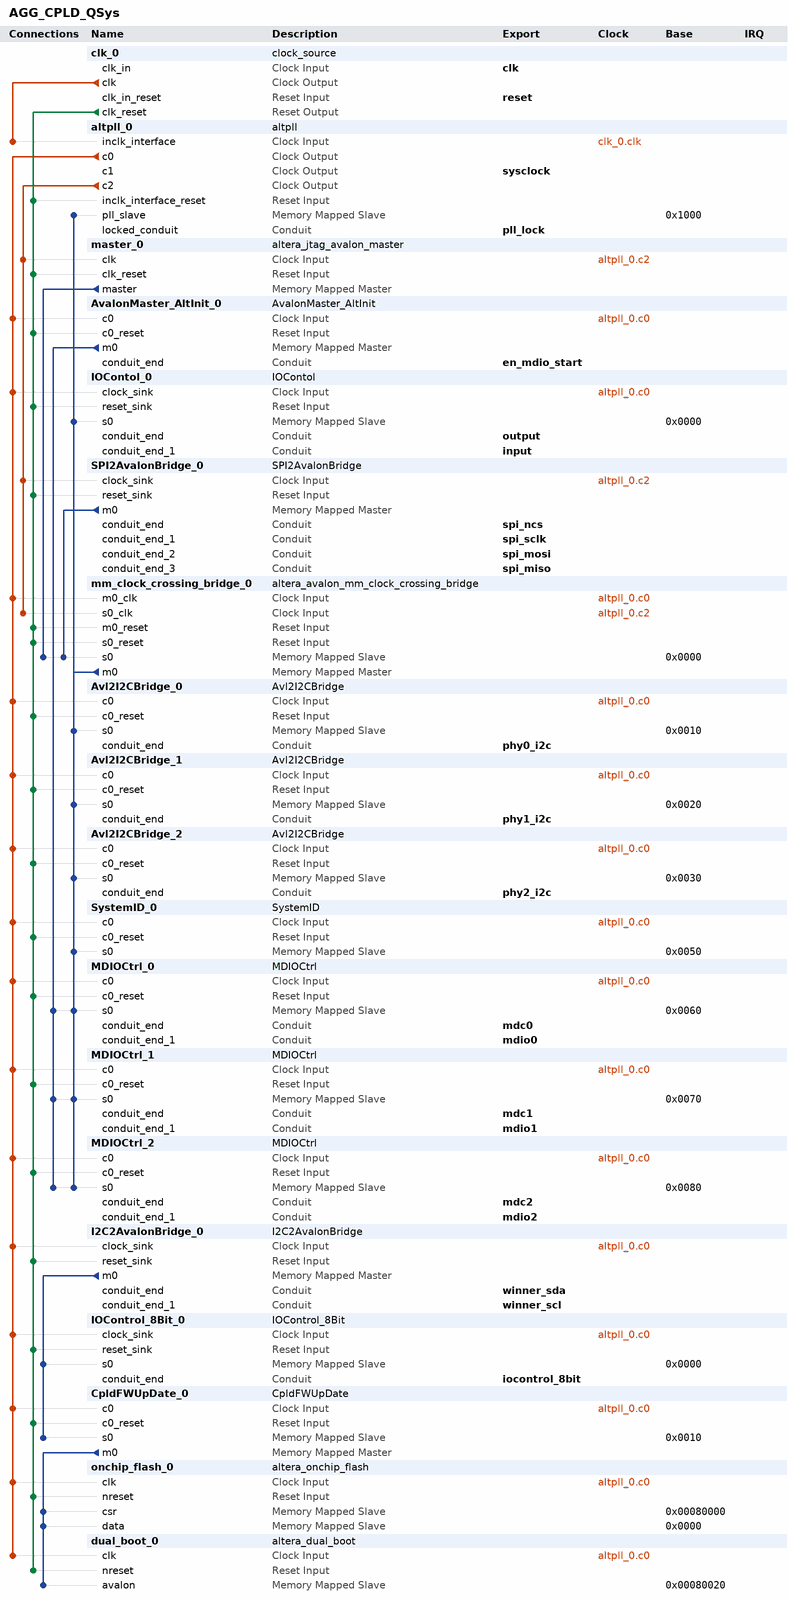
[diagram p0: system contents]
# Platform Designer (Qsys) system AGG_CPLD_QSys, MAX 10 10M16SCU169I7G
# Parameters at their usual value, and those the tool derives, are not listed.
package require -exact qsys 20.1
create_system AGG_CPLD_QSys
set_project_property DEVICE_FAMILY {MAX 10}
set_project_property DEVICE 10M16SCU169I7G

add_instance clk_0 clock_source 20.1
set_instance_parameter_value clk_0 clockFrequency 25000000

add_instance altpll_0 altpll 20.1
set_instance_parameter_value altpll_0 CLK0_DIVIDE_BY 1
set_instance_parameter_value altpll_0 CLK0_MULTIPLY_BY 1
set_instance_parameter_value altpll_0 CLK1_DIVIDE_BY 1
set_instance_parameter_value altpll_0 CLK1_DUTY_CYCLE 50
set_instance_parameter_value altpll_0 CLK1_MULTIPLY_BY 1
set_instance_parameter_value altpll_0 CLK1_PHASE_SHIFT 0
set_instance_parameter_value altpll_0 CLK2_DIVIDE_BY 1
set_instance_parameter_value altpll_0 CLK2_DUTY_CYCLE 50
set_instance_parameter_value altpll_0 CLK2_MULTIPLY_BY 4
set_instance_parameter_value altpll_0 CLK2_PHASE_SHIFT 0
set_instance_parameter_value altpll_0 INCLK0_INPUT_FREQUENCY 40000
set_instance_parameter_value altpll_0 PORT_ARESET PORT_UNUSED
set_instance_parameter_value altpll_0 PORT_LOCKED PORT_USED
set_instance_parameter_value altpll_0 PORT_clk1 PORT_USED
set_instance_parameter_value altpll_0 PORT_clk2 PORT_USED
set_instance_parameter_value altpll_0 PORT_clk3 PORT_UNUSED

add_instance master_0 altera_jtag_avalon_master 20.1

add_instance AvalonMaster_AltInit_0 AvalonMaster_AltInit 1.0

add_instance IOContol_0 IOContol 1.0

add_instance SPI2AvalonBridge_0 SPI2AvalonBridge 1.0

add_instance mm_clock_crossing_bridge_0 altera_avalon_mm_clock_crossing_bridge 20.1
set_instance_parameter_value mm_clock_crossing_bridge_0 ADDRESS_WIDTH 32
set_instance_parameter_value mm_clock_crossing_bridge_0 COMMAND_FIFO_DEPTH 4
set_instance_parameter_value mm_clock_crossing_bridge_0 DATA_WIDTH 32
set_instance_parameter_value mm_clock_crossing_bridge_0 MASTER_SYNC_DEPTH 2
set_instance_parameter_value mm_clock_crossing_bridge_0 MAX_BURST_SIZE 1
set_instance_parameter_value mm_clock_crossing_bridge_0 RESPONSE_FIFO_DEPTH 4
set_instance_parameter_value mm_clock_crossing_bridge_0 SLAVE_SYNC_DEPTH 2
set_instance_parameter_value mm_clock_crossing_bridge_0 USE_AUTO_ADDRESS_WIDTH 1

add_instance Avl2I2CBridge_0 Avl2I2CBridge 1.0

add_instance Avl2I2CBridge_1 Avl2I2CBridge 1.0

add_instance Avl2I2CBridge_2 Avl2I2CBridge 1.0

add_instance SystemID_0 SystemID 1.0

add_instance MDIOCtrl_0 MDIOCtrl 1.0

add_instance MDIOCtrl_1 MDIOCtrl 1.0

add_instance MDIOCtrl_2 MDIOCtrl 1.0

add_instance I2C2AvalonBridge_0 I2C2AvalonBridge 1.0
set_instance_parameter_value I2C2AvalonBridge_0 DevAdd 64

add_instance IOControl_8Bit_0 IOControl_8Bit 1.0

add_instance CpldFWUpDate_0 CpldFWUpDate 1.0

add_instance onchip_flash_0 altera_onchip_flash 20.1
set_instance_parameter_value onchip_flash_0 CLOCK_FREQUENCY 25.0
set_instance_parameter_value onchip_flash_0 CONFIGURATION_MODE {Single Compressed Image}
set_instance_parameter_value onchip_flash_0 SECTOR_ACCESS_MODE {Read and write,Read and write,Read only,Read and write,Read and write}
set_instance_parameter_value onchip_flash_0 initFlashContent false
set_instance_parameter_value onchip_flash_0 initializationFileName altera_onchip_flash.hex
set_instance_parameter_value onchip_flash_0 useNonDefaultInitFile false

add_instance dual_boot_0 altera_dual_boot 20.1
set_instance_parameter_value dual_boot_0 CLOCK_FREQUENCY 25.0

# connections
add_connection altpll_0.c0 AvalonMaster_AltInit_0.c0 clock
add_connection altpll_0.c0 Avl2I2CBridge_0.c0 clock
add_connection altpll_0.c0 Avl2I2CBridge_1.c0 clock
add_connection altpll_0.c0 Avl2I2CBridge_2.c0 clock
add_connection altpll_0.c0 CpldFWUpDate_0.c0 clock
add_connection altpll_0.c0 dual_boot_0.clk clock
add_connection altpll_0.c0 I2C2AvalonBridge_0.clock_sink clock
add_connection altpll_0.c0 IOContol_0.clock_sink clock
add_connection altpll_0.c0 IOControl_8Bit_0.clock_sink clock
add_connection altpll_0.c0 MDIOCtrl_0.c0 clock
add_connection altpll_0.c0 MDIOCtrl_1.c0 clock
add_connection altpll_0.c0 MDIOCtrl_2.c0 clock
add_connection altpll_0.c0 mm_clock_crossing_bridge_0.m0_clk clock
add_connection altpll_0.c0 onchip_flash_0.clk clock
add_connection altpll_0.c0 SystemID_0.c0 clock
add_connection altpll_0.c2 master_0.clk clock
add_connection altpll_0.c2 mm_clock_crossing_bridge_0.s0_clk clock
add_connection altpll_0.c2 SPI2AvalonBridge_0.clock_sink clock
add_connection clk_0.clk altpll_0.inclk_interface clock
add_connection clk_0.clk_reset altpll_0.inclk_interface_reset reset
add_connection clk_0.clk_reset AvalonMaster_AltInit_0.c0_reset reset
add_connection clk_0.clk_reset Avl2I2CBridge_0.c0_reset reset
add_connection clk_0.clk_reset Avl2I2CBridge_1.c0_reset reset
add_connection clk_0.clk_reset Avl2I2CBridge_2.c0_reset reset
add_connection clk_0.clk_reset CpldFWUpDate_0.c0_reset reset
add_connection clk_0.clk_reset dual_boot_0.nreset reset
add_connection clk_0.clk_reset I2C2AvalonBridge_0.reset_sink reset
add_connection clk_0.clk_reset IOContol_0.reset_sink reset
add_connection clk_0.clk_reset IOControl_8Bit_0.reset_sink reset
add_connection clk_0.clk_reset master_0.clk_reset reset
add_connection clk_0.clk_reset MDIOCtrl_0.c0_reset reset
add_connection clk_0.clk_reset MDIOCtrl_1.c0_reset reset
add_connection clk_0.clk_reset MDIOCtrl_2.c0_reset reset
add_connection clk_0.clk_reset mm_clock_crossing_bridge_0.m0_reset reset
add_connection clk_0.clk_reset mm_clock_crossing_bridge_0.s0_reset reset
add_connection clk_0.clk_reset onchip_flash_0.nreset reset
add_connection clk_0.clk_reset SPI2AvalonBridge_0.reset_sink reset
add_connection clk_0.clk_reset SystemID_0.c0_reset reset
add_connection AvalonMaster_AltInit_0.m0 MDIOCtrl_0.s0 avalon
set_connection_parameter_value AvalonMaster_AltInit_0.m0/MDIOCtrl_0.s0 baseAddress 0x0060
add_connection AvalonMaster_AltInit_0.m0 MDIOCtrl_1.s0 avalon
set_connection_parameter_value AvalonMaster_AltInit_0.m0/MDIOCtrl_1.s0 baseAddress 0x0070
add_connection AvalonMaster_AltInit_0.m0 MDIOCtrl_2.s0 avalon
set_connection_parameter_value AvalonMaster_AltInit_0.m0/MDIOCtrl_2.s0 baseAddress 0x0080
add_connection CpldFWUpDate_0.m0 dual_boot_0.avalon avalon
set_connection_parameter_value CpldFWUpDate_0.m0/dual_boot_0.avalon baseAddress 0x00080020
add_connection CpldFWUpDate_0.m0 onchip_flash_0.csr avalon
set_connection_parameter_value CpldFWUpDate_0.m0/onchip_flash_0.csr baseAddress 0x00080000
add_connection CpldFWUpDate_0.m0 onchip_flash_0.data avalon
set_connection_parameter_value CpldFWUpDate_0.m0/onchip_flash_0.data baseAddress 0x0000
add_connection I2C2AvalonBridge_0.m0 CpldFWUpDate_0.s0 avalon
set_connection_parameter_value I2C2AvalonBridge_0.m0/CpldFWUpDate_0.s0 baseAddress 0x0010
add_connection I2C2AvalonBridge_0.m0 IOControl_8Bit_0.s0 avalon
set_connection_parameter_value I2C2AvalonBridge_0.m0/IOControl_8Bit_0.s0 baseAddress 0x0000
add_connection master_0.master mm_clock_crossing_bridge_0.s0 avalon
set_connection_parameter_value master_0.master/mm_clock_crossing_bridge_0.s0 baseAddress 0x0000
add_connection mm_clock_crossing_bridge_0.m0 altpll_0.pll_slave avalon
set_connection_parameter_value mm_clock_crossing_bridge_0.m0/altpll_0.pll_slave baseAddress 0x1000
add_connection mm_clock_crossing_bridge_0.m0 Avl2I2CBridge_0.s0 avalon
set_connection_parameter_value mm_clock_crossing_bridge_0.m0/Avl2I2CBridge_0.s0 baseAddress 0x0010
add_connection mm_clock_crossing_bridge_0.m0 Avl2I2CBridge_1.s0 avalon
set_connection_parameter_value mm_clock_crossing_bridge_0.m0/Avl2I2CBridge_1.s0 baseAddress 0x0020
add_connection mm_clock_crossing_bridge_0.m0 Avl2I2CBridge_2.s0 avalon
set_connection_parameter_value mm_clock_crossing_bridge_0.m0/Avl2I2CBridge_2.s0 baseAddress 0x0030
add_connection mm_clock_crossing_bridge_0.m0 IOContol_0.s0 avalon
set_connection_parameter_value mm_clock_crossing_bridge_0.m0/IOContol_0.s0 baseAddress 0x0000
add_connection mm_clock_crossing_bridge_0.m0 MDIOCtrl_0.s0 avalon
set_connection_parameter_value mm_clock_crossing_bridge_0.m0/MDIOCtrl_0.s0 baseAddress 0x0060
add_connection mm_clock_crossing_bridge_0.m0 MDIOCtrl_1.s0 avalon
set_connection_parameter_value mm_clock_crossing_bridge_0.m0/MDIOCtrl_1.s0 baseAddress 0x0070
add_connection mm_clock_crossing_bridge_0.m0 MDIOCtrl_2.s0 avalon
set_connection_parameter_value mm_clock_crossing_bridge_0.m0/MDIOCtrl_2.s0 baseAddress 0x0080
add_connection mm_clock_crossing_bridge_0.m0 SystemID_0.s0 avalon
set_connection_parameter_value mm_clock_crossing_bridge_0.m0/SystemID_0.s0 baseAddress 0x0050
add_connection SPI2AvalonBridge_0.m0 mm_clock_crossing_bridge_0.s0 avalon
set_connection_parameter_value SPI2AvalonBridge_0.m0/mm_clock_crossing_bridge_0.s0 baseAddress 0x0000

# exported interfaces
add_interface clk clock sink
set_interface_property clk EXPORT_OF clk_0.clk_in
add_interface en_mdio_start conduit end
set_interface_property en_mdio_start EXPORT_OF AvalonMaster_AltInit_0.conduit_end
add_interface input conduit end
set_interface_property input EXPORT_OF IOContol_0.conduit_end_1
add_interface iocontrol_8bit conduit end
set_interface_property iocontrol_8bit EXPORT_OF IOControl_8Bit_0.conduit_end
add_interface mdc0 conduit end
set_interface_property mdc0 EXPORT_OF MDIOCtrl_0.conduit_end
add_interface mdc1 conduit end
set_interface_property mdc1 EXPORT_OF MDIOCtrl_1.conduit_end
add_interface mdc2 conduit end
set_interface_property mdc2 EXPORT_OF MDIOCtrl_2.conduit_end
add_interface mdio0 conduit end
set_interface_property mdio0 EXPORT_OF MDIOCtrl_0.conduit_end_1
add_interface mdio1 conduit end
set_interface_property mdio1 EXPORT_OF MDIOCtrl_1.conduit_end_1
add_interface mdio2 conduit end
set_interface_property mdio2 EXPORT_OF MDIOCtrl_2.conduit_end_1
add_interface output conduit end
set_interface_property output EXPORT_OF IOContol_0.conduit_end
add_interface phy0_i2c conduit end
set_interface_property phy0_i2c EXPORT_OF Avl2I2CBridge_0.conduit_end
add_interface phy1_i2c conduit end
set_interface_property phy1_i2c EXPORT_OF Avl2I2CBridge_1.conduit_end
add_interface phy2_i2c conduit end
set_interface_property phy2_i2c EXPORT_OF Avl2I2CBridge_2.conduit_end
add_interface pll_lock conduit end
set_interface_property pll_lock EXPORT_OF altpll_0.locked_conduit
add_interface reset reset sink
set_interface_property reset EXPORT_OF clk_0.clk_in_reset
add_interface spi_miso conduit end
set_interface_property spi_miso EXPORT_OF SPI2AvalonBridge_0.conduit_end_3
add_interface spi_mosi conduit end
set_interface_property spi_mosi EXPORT_OF SPI2AvalonBridge_0.conduit_end_2
add_interface spi_ncs conduit end
set_interface_property spi_ncs EXPORT_OF SPI2AvalonBridge_0.conduit_end
add_interface spi_sclk conduit end
set_interface_property spi_sclk EXPORT_OF SPI2AvalonBridge_0.conduit_end_1
add_interface sysclock clock source
set_interface_property sysclock EXPORT_OF altpll_0.c1
add_interface winner_scl conduit end
set_interface_property winner_scl EXPORT_OF I2C2AvalonBridge_0.conduit_end_1
add_interface winner_sda conduit end
set_interface_property winner_sda EXPORT_OF I2C2AvalonBridge_0.conduit_end

set_interconnect_requirement {$system} qsys_mm.clockCrossingAdapter HANDSHAKE
set_interconnect_requirement {$system} qsys_mm.enableEccProtection FALSE
set_interconnect_requirement {$system} qsys_mm.insertDefaultSlave FALSE
set_interconnect_requirement {$system} qsys_mm.maxAdditionalLatency 1

save_system AGG_CPLD_QSys.qsys
